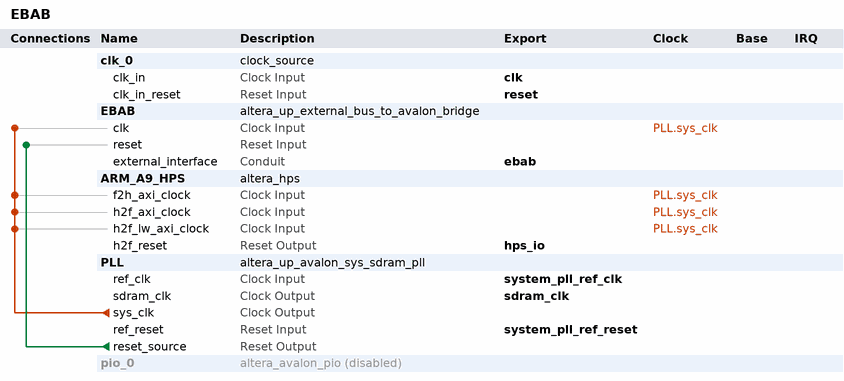
[diagram p0: system contents]
# Platform Designer (Qsys) system EBAB, Cyclone V 5CSEMA5F31A7
# Parameters at their usual value, and those the tool derives, are not listed.
package require -exact qsys 23.1
create_system EBAB
set_project_property DEVICE_FAMILY {Cyclone V}
set_project_property DEVICE 5CSEMA5F31A7

add_instance clk_0 clock_source 23.1
set_instance_parameter_value clk_0 clockFrequency 50000000

add_instance EBAB altera_up_external_bus_to_avalon_bridge 18.0
set_instance_parameter_value EBAB addr_size 4
set_instance_parameter_value EBAB addr_size_multiplier Kbytes
set_instance_parameter_value EBAB data_size 16

add_instance ARM_A9_HPS altera_hps 23.1
set_instance_parameter_value ARM_A9_HPS EMAC1_Mode N/A
set_instance_parameter_value ARM_A9_HPS EMAC1_PinMuxing Unused
set_instance_parameter_value ARM_A9_HPS F2SCLK_COLDRST_Enable false
set_instance_parameter_value ARM_A9_HPS F2SCLK_DBGRST_Enable false
set_instance_parameter_value ARM_A9_HPS F2SCLK_WARMRST_Enable false
set_instance_parameter_value ARM_A9_HPS F2SINTERRUPT_Enable true
set_instance_parameter_value ARM_A9_HPS F2S_Width 2
set_instance_parameter_value ARM_A9_HPS FPGA_PERIPHERAL_OUTPUT_CLOCK_FREQ_EMAC0_GTX_CLK 125
set_instance_parameter_value ARM_A9_HPS FPGA_PERIPHERAL_OUTPUT_CLOCK_FREQ_EMAC0_MD_CLK 2.5
set_instance_parameter_value ARM_A9_HPS FPGA_PERIPHERAL_OUTPUT_CLOCK_FREQ_EMAC1_GTX_CLK 125
set_instance_parameter_value ARM_A9_HPS FPGA_PERIPHERAL_OUTPUT_CLOCK_FREQ_EMAC1_MD_CLK 2.5
set_instance_parameter_value ARM_A9_HPS HPS_PROTOCOL DDR3
set_instance_parameter_value ARM_A9_HPS I2C0_Mode N/A
set_instance_parameter_value ARM_A9_HPS I2C0_PinMuxing Unused
set_instance_parameter_value ARM_A9_HPS I2C1_Mode N/A
set_instance_parameter_value ARM_A9_HPS I2C1_PinMuxing Unused
set_instance_parameter_value ARM_A9_HPS LWH2F_Enable true
set_instance_parameter_value ARM_A9_HPS MEM_BANKADDR_WIDTH 3
set_instance_parameter_value ARM_A9_HPS MEM_CLK_FREQ 300.0
set_instance_parameter_value ARM_A9_HPS MEM_CLK_FREQ_MAX 400.0
set_instance_parameter_value ARM_A9_HPS MEM_COL_ADDR_WIDTH 8
set_instance_parameter_value ARM_A9_HPS MEM_DQ_WIDTH 8
set_instance_parameter_value ARM_A9_HPS MEM_DRV_STR RZQ/6
set_instance_parameter_value ARM_A9_HPS MEM_ROW_ADDR_WIDTH 12
set_instance_parameter_value ARM_A9_HPS MEM_RTT_NOM {ODT Disabled}
set_instance_parameter_value ARM_A9_HPS MEM_RTT_WR {Dynamic ODT off}
set_instance_parameter_value ARM_A9_HPS MEM_TCL 7
set_instance_parameter_value ARM_A9_HPS MEM_TFAW_NS 37.5
set_instance_parameter_value ARM_A9_HPS MEM_TINIT_US 499
set_instance_parameter_value ARM_A9_HPS MEM_TMRD_CK 3
set_instance_parameter_value ARM_A9_HPS MEM_TRAS_NS 40.0
set_instance_parameter_value ARM_A9_HPS MEM_TRCD_NS 15.0
set_instance_parameter_value ARM_A9_HPS MEM_TREFI_US 7.0
set_instance_parameter_value ARM_A9_HPS MEM_TRFC_NS 75.0
set_instance_parameter_value ARM_A9_HPS MEM_TRP_NS 15.0
set_instance_parameter_value ARM_A9_HPS MEM_TWTR 2
set_instance_parameter_value ARM_A9_HPS MEM_VENDOR JEDEC
set_instance_parameter_value ARM_A9_HPS MEM_WTCL 6
set_instance_parameter_value ARM_A9_HPS QSPI_Mode N/A
set_instance_parameter_value ARM_A9_HPS QSPI_PinMuxing Unused
set_instance_parameter_value ARM_A9_HPS REF_CLK_FREQ 125.0
set_instance_parameter_value ARM_A9_HPS S2FCLK_USER2CLK 5
set_instance_parameter_value ARM_A9_HPS S2F_Width 3
set_instance_parameter_value ARM_A9_HPS SDIO_Mode N/A
set_instance_parameter_value ARM_A9_HPS SDIO_PinMuxing Unused
set_instance_parameter_value ARM_A9_HPS SPIM1_Mode N/A
set_instance_parameter_value ARM_A9_HPS SPIM1_PinMuxing Unused
set_instance_parameter_value ARM_A9_HPS STM_Enable false
set_instance_parameter_value ARM_A9_HPS TIMING_BOARD_AC_SKEW 0.02
set_instance_parameter_value ARM_A9_HPS TIMING_BOARD_AC_TO_CK_SKEW 0.0
set_instance_parameter_value ARM_A9_HPS TIMING_BOARD_DQ_TO_DQS_SKEW 0.0
set_instance_parameter_value ARM_A9_HPS TIMING_BOARD_MAX_CK_DELAY 0.6
set_instance_parameter_value ARM_A9_HPS TIMING_BOARD_MAX_DQS_DELAY 0.6
set_instance_parameter_value ARM_A9_HPS TIMING_BOARD_SKEW_BETWEEN_DQS 0.02
set_instance_parameter_value ARM_A9_HPS TIMING_BOARD_SKEW_CKDQS_DIMM_MAX 0.01
set_instance_parameter_value ARM_A9_HPS TIMING_BOARD_SKEW_CKDQS_DIMM_MIN -0.01
set_instance_parameter_value ARM_A9_HPS TIMING_BOARD_SKEW_WITHIN_DQS 0.02
set_instance_parameter_value ARM_A9_HPS TIMING_TDH 125
set_instance_parameter_value ARM_A9_HPS TIMING_TDQSCK 400
set_instance_parameter_value ARM_A9_HPS TIMING_TDQSQ 120
set_instance_parameter_value ARM_A9_HPS TIMING_TDS 50
set_instance_parameter_value ARM_A9_HPS TIMING_TIH 250
set_instance_parameter_value ARM_A9_HPS TIMING_TIS 175
set_instance_parameter_value ARM_A9_HPS TIMING_TQSH 0.38
set_instance_parameter_value ARM_A9_HPS UART0_Mode N/A
set_instance_parameter_value ARM_A9_HPS UART0_PinMuxing Unused
set_instance_parameter_value ARM_A9_HPS USB1_Mode N/A
set_instance_parameter_value ARM_A9_HPS USB1_PinMuxing Unused
set_instance_parameter_value ARM_A9_HPS desired_cfg_clk_mhz 100.0
set_instance_parameter_value ARM_A9_HPS desired_qspi_clk_mhz 400.0

add_instance PLL altera_up_avalon_sys_sdram_pll 18.0
set_instance_parameter_value PLL CV_boards DE1-SoC
set_instance_parameter_value PLL gui_outclk 100.0
set_instance_parameter_value PLL gui_refclk 50.0

add_instance pio_0 altera_avalon_pio 23.1
set_instance_property pio_0 ENABLED false
set_instance_parameter_value pio_0 direction Input
set_instance_parameter_value pio_0 width 32

# connections
add_connection PLL.sys_clk ARM_A9_HPS.f2h_axi_clock clock
add_connection PLL.sys_clk ARM_A9_HPS.h2f_axi_clock clock
add_connection PLL.sys_clk ARM_A9_HPS.h2f_lw_axi_clock clock
add_connection PLL.sys_clk EBAB.clk clock
add_connection PLL.reset_source EBAB.reset reset

# exported interfaces
add_interface clk clock sink
set_interface_property clk EXPORT_OF clk_0.clk_in
add_interface ebab conduit end
set_interface_property ebab EXPORT_OF EBAB.external_interface
add_interface hps_io reset source
set_interface_property hps_io EXPORT_OF ARM_A9_HPS.h2f_reset
add_interface reset reset sink
set_interface_property reset EXPORT_OF clk_0.clk_in_reset
add_interface sdram_clk clock source
set_interface_property sdram_clk EXPORT_OF PLL.sdram_clk
add_interface system_pll_ref_clk clock sink
set_interface_property system_pll_ref_clk EXPORT_OF PLL.ref_clk
add_interface system_pll_ref_reset reset sink
set_interface_property system_pll_ref_reset EXPORT_OF PLL.ref_reset

set_interconnect_requirement {$system} qsys_mm.clockCrossingAdapter HANDSHAKE
set_interconnect_requirement {$system} qsys_mm.enableEccProtection FALSE
set_interconnect_requirement {$system} qsys_mm.insertDefaultSlave FALSE
set_interconnect_requirement {$system} qsys_mm.maxAdditionalLatency 1

save_system EBAB.qsys
